# EAGLE design PARduino (EAGLE 6.4)
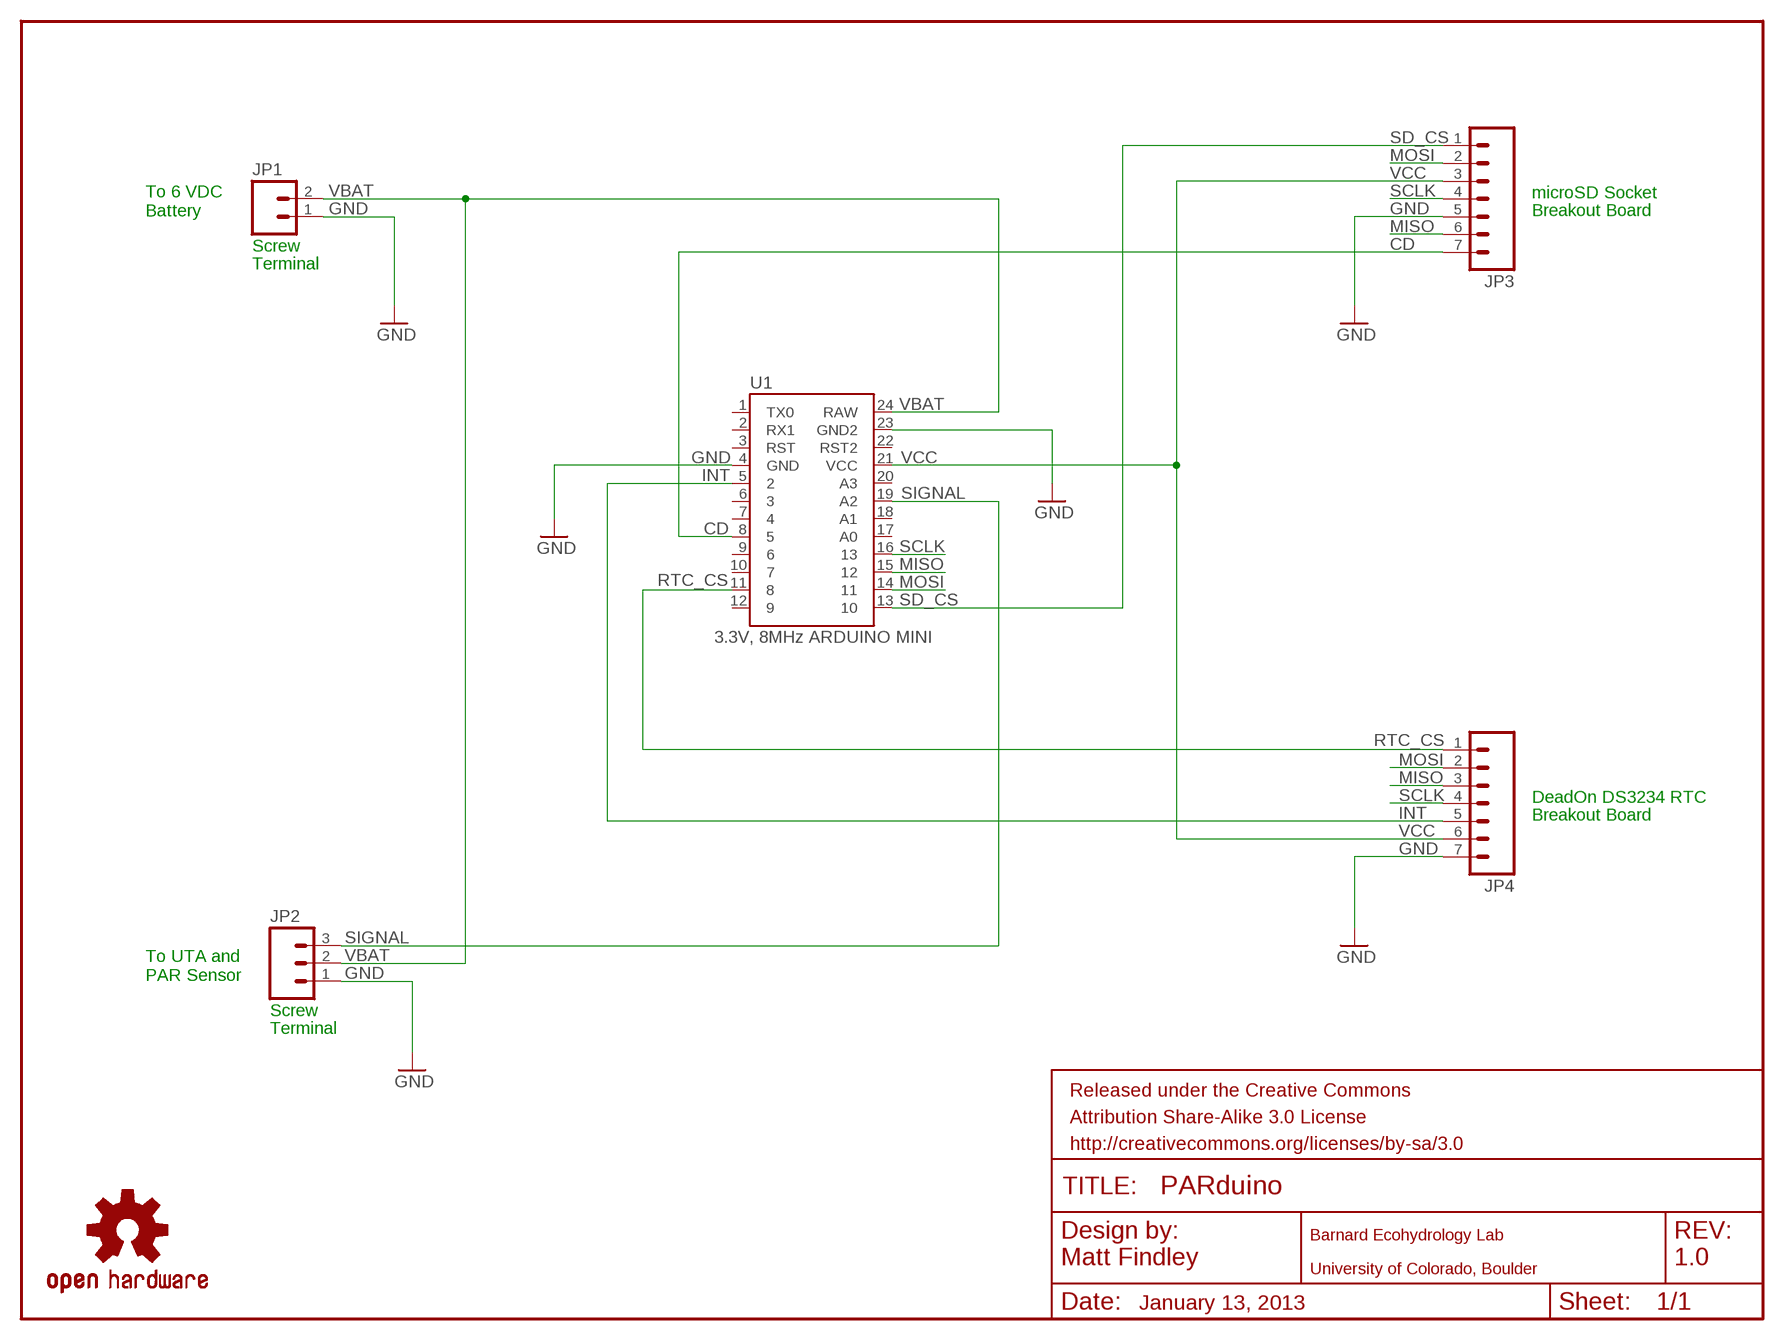
[diagram p0: schematic, sheet 1]

## Parts
JP1  M023.5MM_LOCK  [SCREWTERMINAL-3.5MM-2_LOCK]
JP2  M03SCREW  [SCREWTERMINAL-3.5MM-3]
JP3  M07LOCK  [1X07_LOCK]
JP4  M07LOCK  [1X07_LOCK]
LOGO  OSHW-LOGOL  [OSHW-LOGO-L]
U1  3.3V, 8MHz ARDUINO MINI  ARDUINO_MINI  [ARDUINO_MINI]

## Nets
CD: JP3.7 U1.8
GND: JP1.1 JP2.1 JP3.5 JP4.7 U1.4(GND) U1.23(GND2)
INT: JP4.5 U1.5
MISO: JP3.6 JP4.3 U1.15
MOSI: JP3.2 JP4.2 U1.14
RTC_CS: JP4.1 U1.11
SCLK: JP3.4 JP4.4 U1.16
SD_CS: JP3.1 U1.13
SIGNAL: JP2.3 U1.19(A2)
VBAT: JP1.2 JP2.2 U1.24(RAW)
VCC: JP3.3 JP4.6 U1.21(VCC)
Unconnected: U1.1(TX0) U1.2(RX1) U1.3(RST) U1.6 U1.7 U1.9 U1.10 U1.12 U1.17(A0) U1.18(A1) U1.20(A3) U1.22(RST2)

## Notes on the sheet
- microSD Socket
- To 6 VDC 
  Battery
- Breakout Board
- Screw
- Terminal
- DeadOn DS3234 RTC
- Breakout Board
- To UTA and 
  PAR Sensor
- Screw
- Terminal
- Barnard Ecohydrology Lab
- Matt Findley | 1.0
- University of Colorado, Boulder
- January 13, 2013

## Library data of the parts
JP1 = SparkFun-Connectors:M02: Header 2 Standard 2-pin 0.1" header. Use with straight break away headers (SKU : PRT-00116), right angle break away headers (PRT-00553), swiss pins (PRT-00743), machine pins (PRT-00117), and female headers (PRT-00115). Molex polarized connector foot print use with SKU : PRT-08233 with associated crimp pins and housings.
JP2 = SparkFun-Connectors:M03: Header 3 Standard 3-pin 0.1" header. Use with straight break away headers (SKU : PRT-00116), right angle break away headers (PRT-00553), swiss pins (PRT-00743), machine pins (PRT-00117), and female headers (PRT-00115). Molex polarized connector foot print use with SKU : PRT-08232 with associated crimp pins and housings.
JP3 JP4 = SparkFun-Connectors:M07: Header 7 Standard 7-pin 0.1" header. Use with straight break away headers (SKU : PRT-00116), right angle break away headers (PRT-00553), swiss pins (PRT-00743), machine pins (PRT-00117), and female headers (PRT-00115). NOTES ON THE VARIANTS LOCK and LOCK_LONGPADS... This footprint was designed to help hold the alignment of a through-hole component (i.e. 7-pin header) while soldering it into place. You may notice that each hole has been shifted either up or down by 0.005 of an inch from it's more standard position (which is usually a perfectly straight line). This slight alteration caused the pins (the squares in the middle) to touch the edges of the holes. Because they are alternating, it causes a "brace" to hold the header in place. 0.005 has proven to be the perfect amount of "off-center" position when using our standard breakaway headers. Although looks a little odd when you look at the bare footprint, once you have a header in there, the alteration is very hard to notice. Also, if you push a header all the way into place, it is covered up entirely on the bottom side. This idea of altering the position of holes to aid alignment will be further integrated into the Sparkfun Library for other footprints. It can help hold any component with 3 or more connection pins.
LOGO = SparkFun-Aesthetics:OSHW-LOGO: Open Source Hardware Logo This logo indicates the piece of hardware it is found on incorporates a OSHW license and/or adheres to the definition of open source hardware found here: http://freedomdefined.org/OSHW
U1 = SparkFun-Boards:ARDUINO_MINI: Arduino Pro Mini footprint

## Board
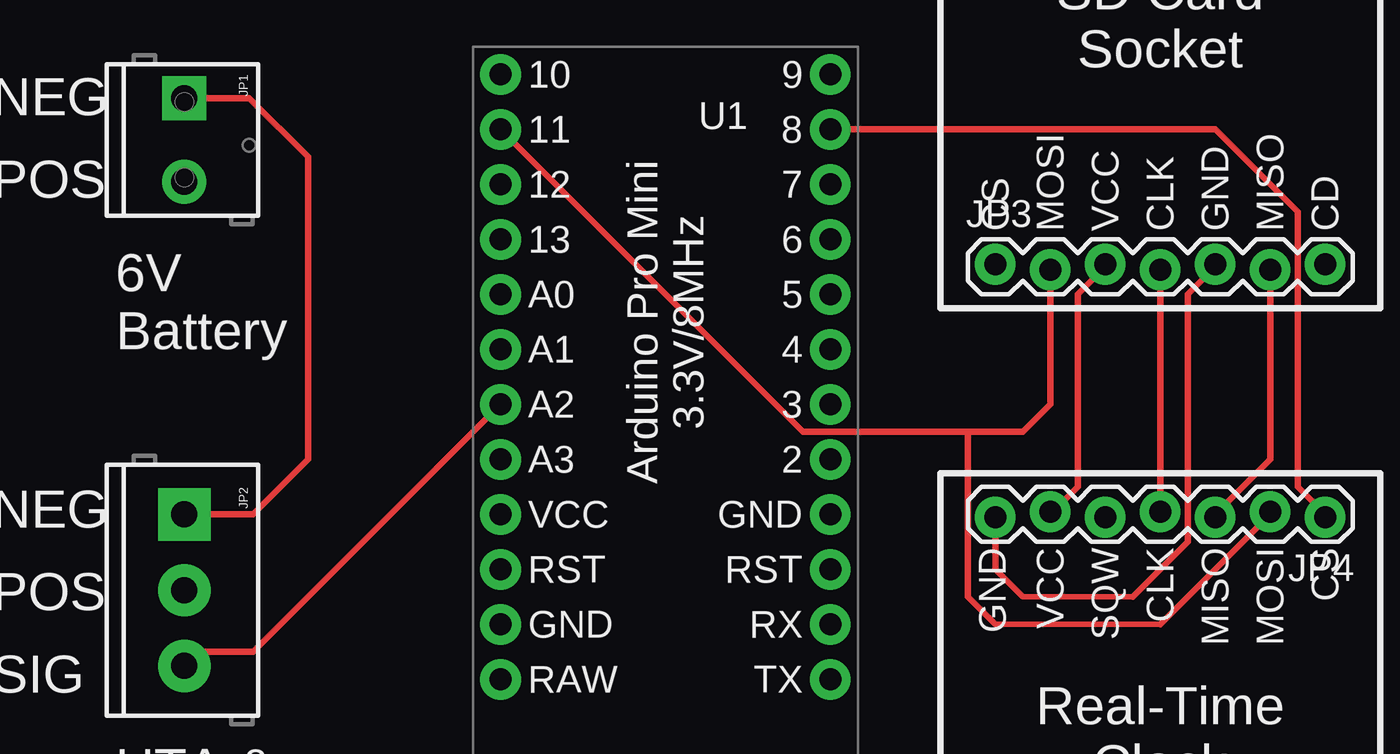
[diagram p1: board, top side]
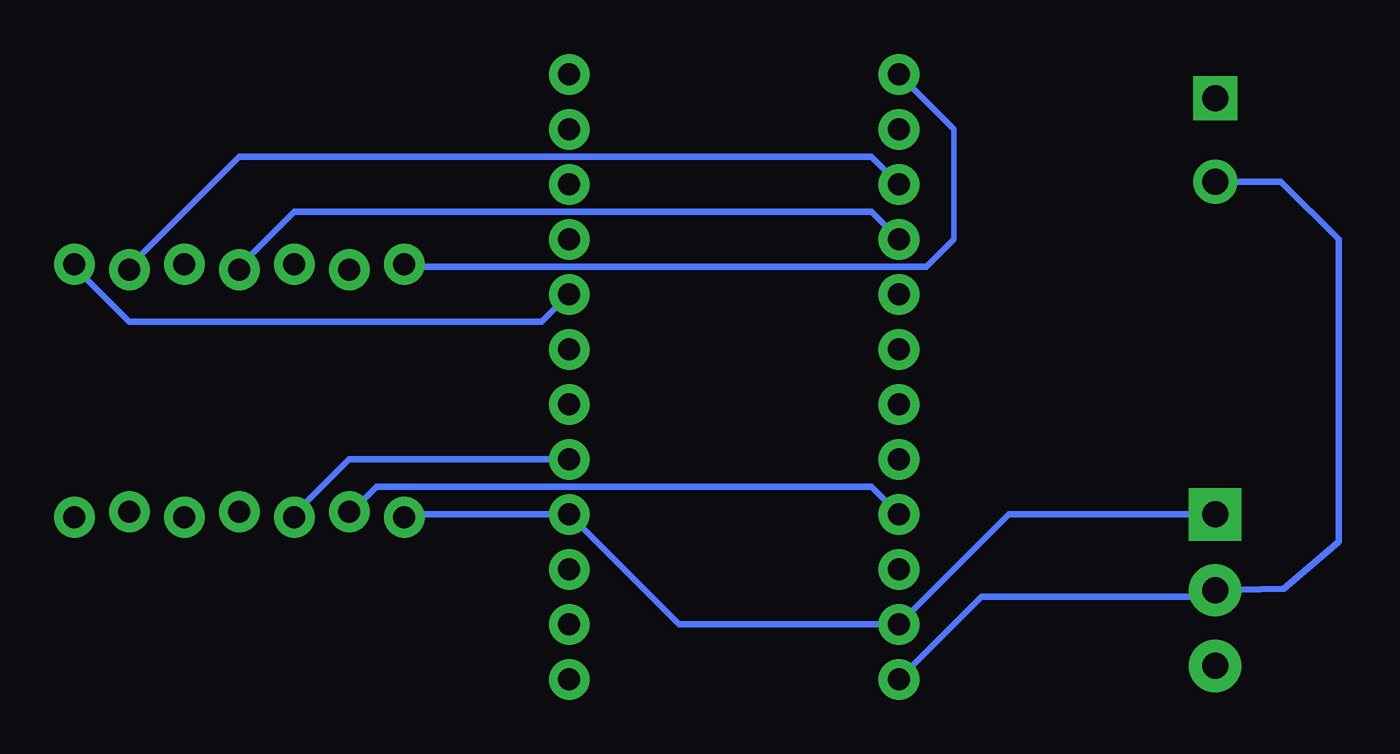
[diagram p2: board, bottom side, seen from below]

No outline drawn. Coordinates in mm, seen from the top.
Copper layers (1*16): Top 0.035mm / dielectric 1.5mm / Bottom 0.035mm
Design rules "default": minimum track width 10mil, minimum drill 24mil, track to track 8mil, track to pad 8mil, pad to pad 8mil, via to via 8mil, smd to smd 8mil, copper to edge 40mil, drill to drill 8mil, minimum pad ring 10mil, minimum via ring 8mil, stop-mask expansion 4mil, vias tented up to drill 0mil, thermal gap 10mil

### Footprints (pad centres in the part's own frame; a part is rotated, then mirrored left to right if it is on the bottom)
SCREWTERMINAL-3.5MM-2_LOCK = drill 1.2 pad 2.032 square: 1 -0.178,0 | drill 1.2 pad 2.032: 2 3.678,0
SCREWTERMINAL-3.5MM-3 = drill 1.2 pad 2.413 square: 1 0,0 | drill 1.2 pad 2.413: 2 3.5,0; 3 7,0
1X07_LOCK = drill 1.016 pad 1.88: 1 0,0.127; 2 2.54,-0.127; 3 5.08,0.127; 4 7.62,-0.127; 5 10.16,0.127; 6 12.7,-0.127; 7 15.24,0.127
ARDUINO_MINI = drill 1.016 pad 1.88: 1 -7.62,12.7; 2 -7.62,10.16; 3 -7.62,7.62; 4 -7.62,5.08; 5 -7.62,2.54; 6 -7.62,0; 7 -7.62,-2.54; 8 -7.62,-5.08; 9 -7.62,-7.62; 10 -7.62,-10.16; 11 -7.62,-12.7; 12 -7.62,-15.24; 13 7.62,-15.24; 14 7.62,-12.7; 15 7.62,-10.16; 16 7.62,-7.62; 17 7.62,-5.08; 18 7.62,-2.54; 19 7.62,0; 20 7.62,2.54; 21 7.62,5.08; 22 7.62,7.62; 23 7.62,10.16; 24 7.62,12.7
STAND-OFF = hole 3.302: 0,0

### Placement (x,y rotation side)
JP1  12.06,39.37 270 top
JP2  12.06,20.32 270 top
JP3  49.53,31.75 0 top
JP4  64.77,20.32 180 top
LOGO  13.97,48.26 0 top
U1  34.29,25.4 180 top
U$1  [STAND-OFF]  5.08,49.53 0 top
U$2  [STAND-OFF]  5.08,5.08 0 top
U$3  [STAND-OFF]  73.66,5.08 0 top
U$4  [STAND-OFF]  73.66,49.53 0 top

### Tracks (layer width: path | path; a pad name or v marks a point on that pad's centre or on a via)
CD
  Top 0.254: 64.77,31.75 JP3.7
  Bottom 0.254: 64.77,31.75 JP3.7
  Bottom 0.305: U1.8 43.18,29.21 62.23,29.21 64.77,31.75
GND
  Top 0.254: 49.53,17.78 50.8,16.51 55.88,16.51 | 59.69,31.75 JP3.5
  Top 0.305: JP1.1 15.06,39.55 17.78,36.83 17.78,22.86 15.24,20.32 JP2.1 | 59.69,31.75 58.42,30.48 58.42,19.05 55.88,16.51 | 49.53,17.78 JP4.7 49.53,20.32
  Bottom 0.254: 49.53,20.32 JP4.7
  Bottom 0.305: JP2.1 21.59,20.32 U1.23 36.83,15.24 U1.4 49.53,20.32
INT
  Bottom 0.305: U1.5 52.07,22.86 54.61,20.32 JP4.5
MISO
  Top 0.254: 62.23,31.75 JP3.6
  Top 0.305: JP3.6 62.23,22.86 59.69,20.32 JP4.3
  Bottom 0.254: 59.69,20.32 JP4.3 | 27.94,36.83 U1.15 | 62.23,31.75 JP3.6
  Bottom 0.305: 27.94,36.83 57.15,36.83 62.23,31.75
MOSI
  Top 0.254: 48.26,16.51 49.53,15.24 57.15,15.24
  Top 0.305: 48.26,24.13 50.8,24.13 52.07,25.4 JP3.2 52.07,31.75 | 48.26,24.13 40.64,24.13 U1.14 | 57.15,15.24 62.23,20.32 JP4.2 | 48.26,24.13 48.26,16.51
RTC_CS
  Top 0.305: U1.11 59.69,38.1 63.5,34.29 63.5,21.59 64.77,20.32 JP4.1
  Bottom 0.254: 64.77,20.32 JP4.1
SCLK
  Top 0.254: 57.15,31.75 JP3.4
  Top 0.305: JP3.4 JP4.4 57.15,20.32
  Bottom 0.254: 27.94,34.29 U1.16 | 57.15,31.75 JP3.4
  Bottom 0.305: 27.94,34.29 54.61,34.29 57.15,31.75
SD_CS
  Top 0.254: 49.53,31.75 JP3.1
  Bottom 0.254: U1.13 24.13,38.1 24.13,33.02 25.4,31.75
  Bottom 0.305: 25.4,31.75 49.53,31.75 JP3.1
SIGNAL
  Top 0.305: U1.19 15.24,13.97 12.7,13.97 JP2.3
VBAT
  Bottom 0.305: JP1.2 9.02,35.69 6.35,33.02 6.35,19.05 8.89,16.89 JP2.2 12.7,16.51 22.86,16.51 U1.24
VCC
  Top 0.254: 54.61,31.75 JP3.3
  Top 0.305: 54.61,31.75 53.34,30.48 53.34,21.59 52.07,20.32 JP4.6
  Bottom 0.254: 52.07,20.32 JP4.6
  Bottom 0.305: U1.21 27.94,21.59 50.8,21.59 52.07,20.32

### Text on the board
tPlace: PARduino / February 2013 | SD Card / Socket | 10 | 9 | NEG | 11 | 8 | 12 | 7 | POS | 13 | 6 | CS | MOSI | VCC | CLK | GND | MISO | CD | A0 | 5 | Arduino Pro Mini / 3.3V/8MHz | 6V / Battery | A1 | 4 | A2 | 3 | A3 | 2 | NEG | VCC | GND | GND | VCC | SQW | CLK | MISO | MOSI | CS | RST | RST | POS | GND | RX | RAW | TX | SIG | Real-Time / Clock | Barnard Ecohydrology Lab / University of Colorado, Boulder | UTA & / PAR Sensor